# Altium schematic sheet Power.SchDoc: =ProjectName
size A4; CheckedBy: DatNB; Author: Ven; CompanyName: Nacentech; Organization: IMET
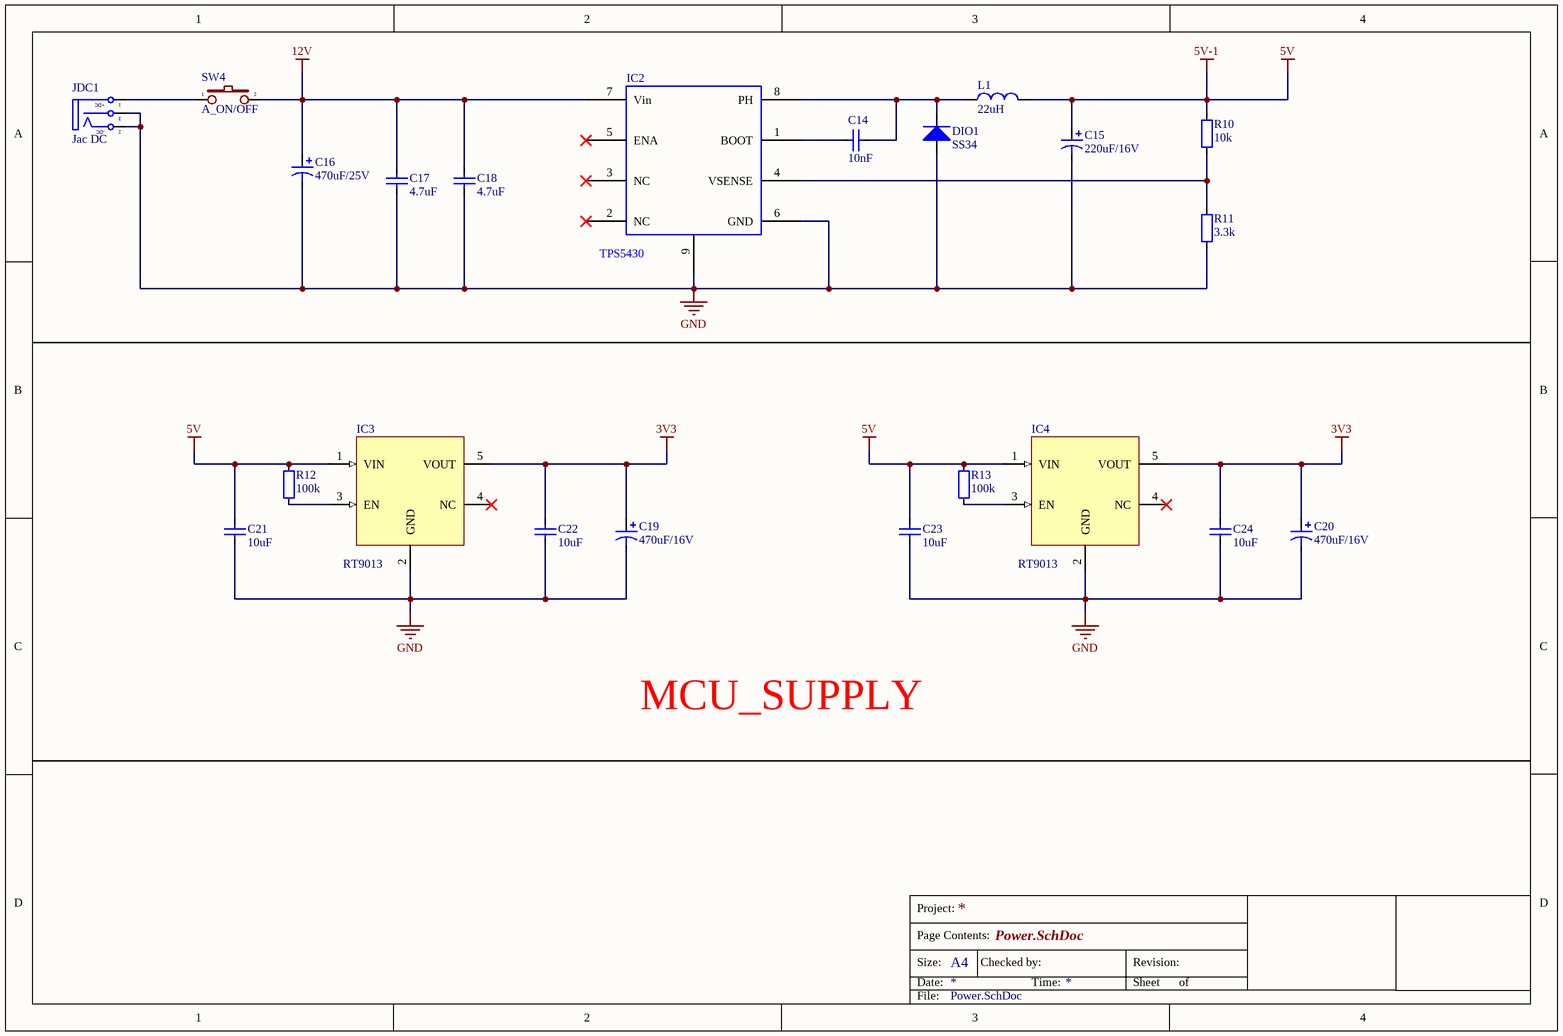
[diagram p0: Power.SchDoc]

## Parts
C14  10nF  [CAP_0805]
C15  220uF/16V  [C8mm]
C16  470uF/25V  [C8mm]
C17  4.7uF  [CAP_0805]
C18  4.7uF  [CAP_0805]
C19  470uF/16V  [C8mm]
C20  470uF/16V  [C8mm]
C21  10uF  [CAP_0805]
C22  10uF  [CAP_0805]
C23  10uF  [CAP_0805]
C24  10uF  [CAP_0805]
DIO1  SS34  [DIO-SMD-106]
IC2  TPS5430  [TPS5430-2]
IC3  RT9013  [SOT23-5]
IC4  RT9013  [SOT23-5]
JDC1  Jac DC  [DC-IN]
L1  22uH  [L-SMD-M-7.3x4.5]
R10  10k  [RES-SMD-0805]
R11  3.3k  [RES-SMD-0805]
R12  100k  [RES-SMD-0805]
R13  100k  [RES-SMD-0805]
SW4  A_ON/OFF  [SW2]

## Nets
3V3: C19.1 C20.1 C22.2 C24.2 IC3.5(VOUT) IC4.5(VOUT)
5V: C15.1 C21.2 C23.2 IC3.1(VIN) IC4.1(VIN) L1.2 R10.2 R12.1 R13.1  [also labelled 5V-1]
12V: C16.1 C17.2 C18.2 IC2.7(Vin) SW4.2
GND: C15.2 C16.2 C17.1 C18.1 C19.2 C20.2 C21.1 C22.1 C23.1 C24.1 DIO1.1(A) IC2.6(GND) IC2.9(PWR_PAD) IC3.2(GND) IC4.2(GND) JDC1.2(TN) JDC1.3(S) R11.1
NetC14_1: C14.1 DIO1.2(K) IC2.8(PH) L1.1
NetC14_2: C14.2 IC2.1(BOOT)
NetIC2_4: IC2.4(VSENSE) R10.1 R11.2
NetIC3_3: IC3.3(EN) R12.2
NetIC4_3: IC4.3(EN) R13.2
NetJDC1_1: JDC1.1(T) SW4.1

Not connected (* = marked no-connect by the designer): IC2 2(NC)* 3(NC)* 5(ENA)*; IC3 4(NC)*; IC4 4(NC)*

## Notes on the sheet
- MCU_SUPPLY
- Project:
- Page Contents:
- Size:
- Date:
- A4
- Checked by:
- Time:
- Revision:
- Sheet
- of
- File:
- (in symbol DCIN) +DC; -DC

## Library data of the parts
C14 C17 C18 C21-C24 = CapSMD: Capacitor; Value: 33p; Published: 8-Jun-2000; LatestRevisionDate: 17-Jul-2002; LatestRevisionNote: Re-released for DXP Platform.; PackageReference: RAD-0.3; Publisher: Altium Limited
C15 C16 C19 C20 = Cap Pol: Polarized Capacitor (Axial); Published: 8-Jun-2000; LatestRevisionDate: 17-Jul-2002; LatestRevisionNote: Re-released for DXP Platform.; PackageReference: POLAR0.8; Publisher: Altium Limited
DIO1 = Diode SMD: Default Diode; Code - JEDEC: DO-214-AB; Value: 1N5007; Published: 8-Jun-2000; Revision: July-2002: Re-released for DXP Platform.; Publisher: Altium Limited
IC3 IC4 = RT9013: RT9013-33GB IC REG LINEAR 3.3V 500mA SOT23-5
JDC1 = DCIN: Jac DC input; Value: Jac DC
L1 = Inductor: Value: 150 mH
R10-R13 = Resistor - SMD: Resistor; Manufacturer: Generic Components; Class: Passive; Published: 08/06/2000; Publisher: Altium Hobart Technology Centre
SW4 = SW2: Switch button 2 pin; Value: SW chip 2 pin
IC2 = TPS5430: Name: TPS5430